# EAGLE schematic x-jalad rev2 (EAGLE 6.4)
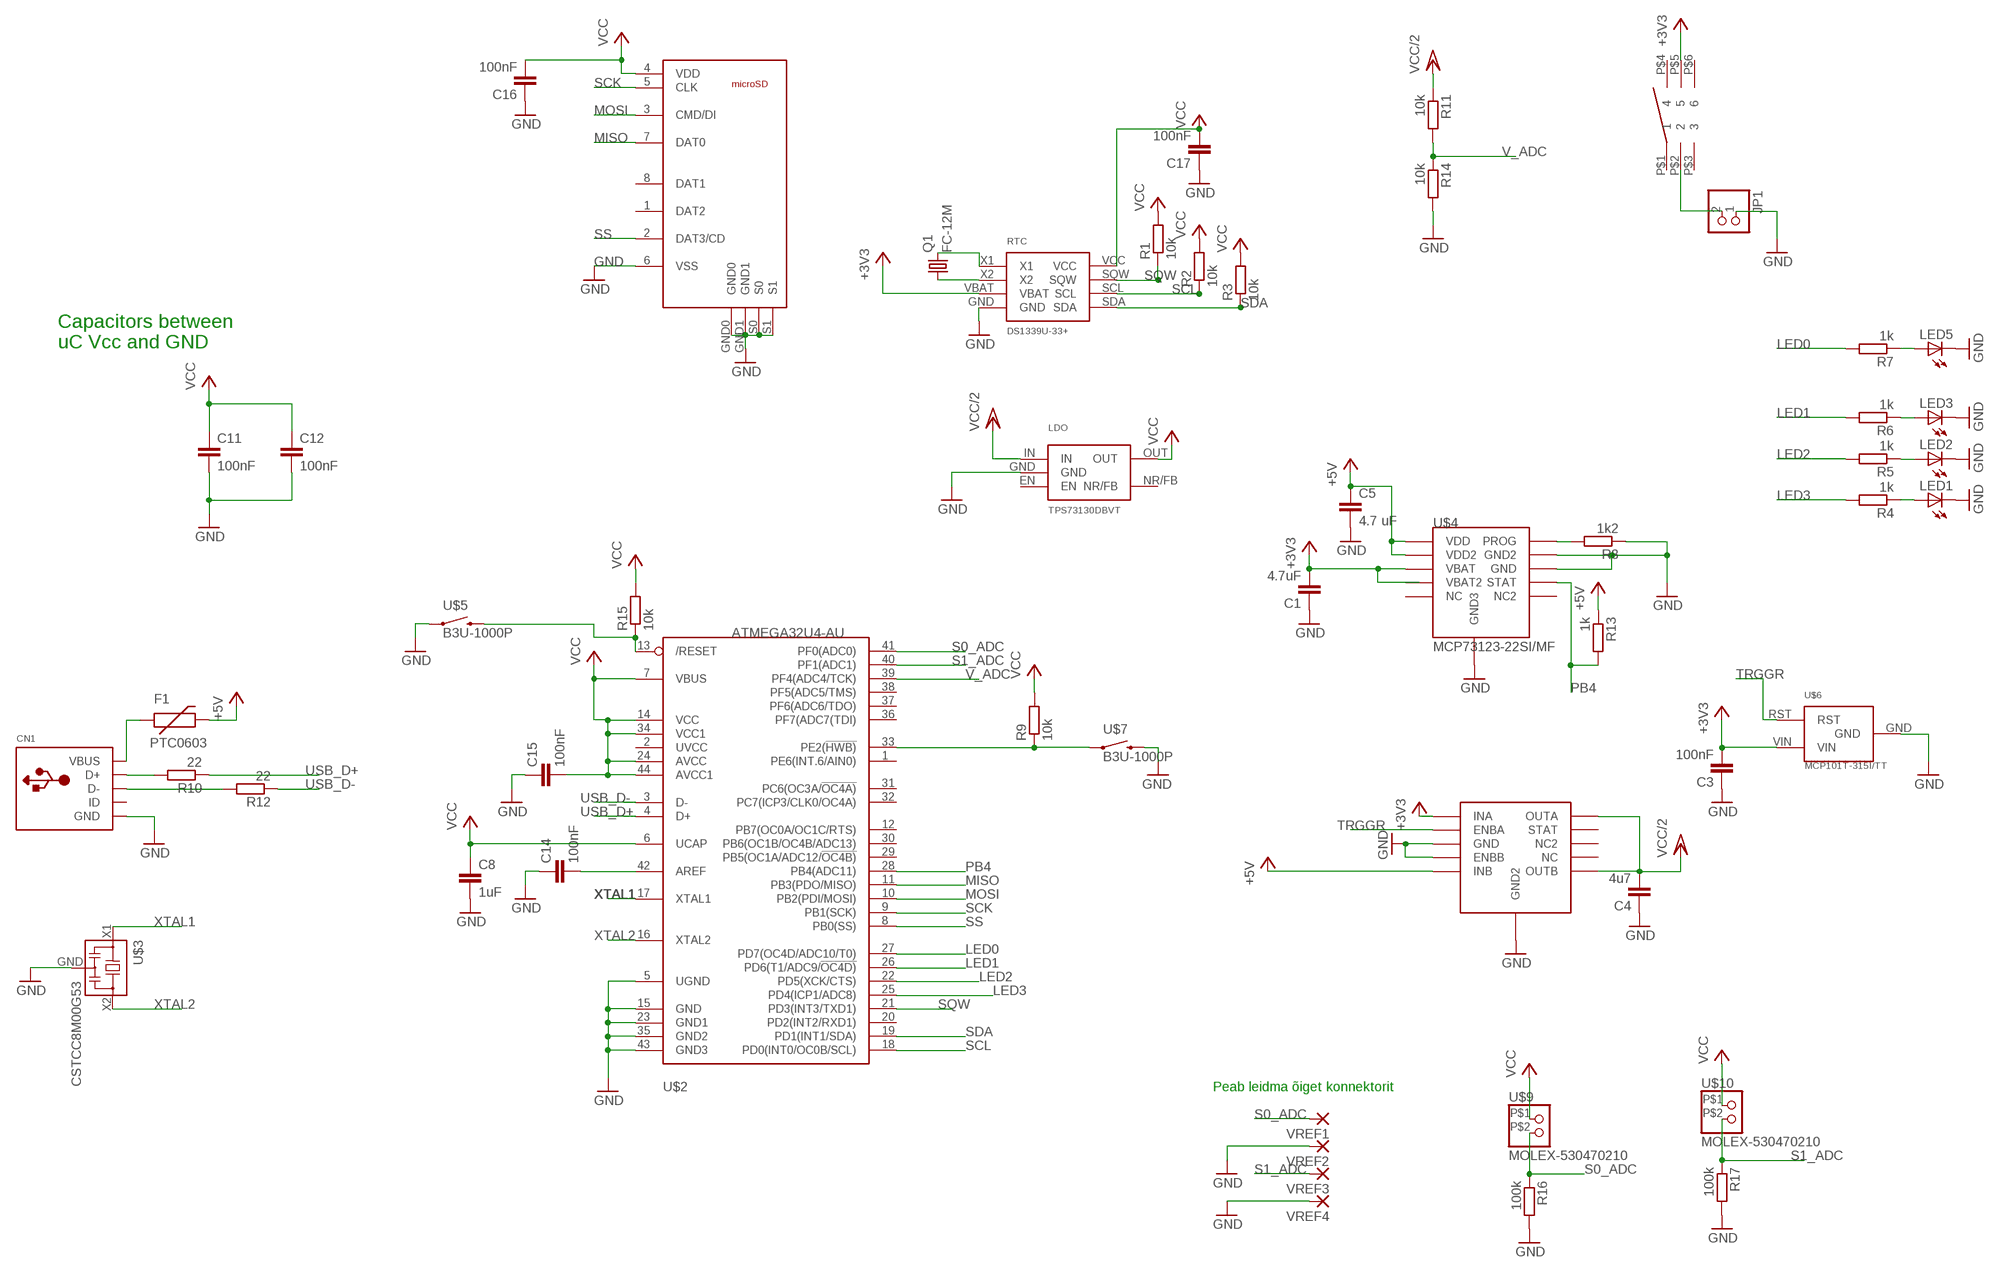
[diagram p0: schematic, sheet 1]

## Parts
2CH_IDEAL_DIODES  LTC4413EDD-1  [DFN10]
C1  4.7uF  CC0402  [C0402]
C3  100nF  CC0402  [C0402]
C4  4u7  CC0402  [C0402]
C5  4.7 uF  C-EUC0603  [C0603]
C8  1uF  CC0402  [C0402]
C11  100nF  CC0402  [C0402]
C12  100nF  CC0402  [C0402]
C14  100nF  CC0402  [C0402]
C15  100nF  CC0402  [C0402]
C16  100nF  CC0402  [C0402]
C17  100nF  CC0402  [C0402]
CN1  USBMINIB  [USB-MINIB]
F1  PTC0603  [0603]
JP1  PINHD-1X2/90  [1X02/90]
LDO  TPS73130DBVT  [SOT23-5]
LED1  LEDLD260  [LD260]
LED2  LEDLD260  [LD260]
LED3  LEDLD260  [LD260]
LED5  LEDLD260  [LD260]
Q1  FC-12M  [FC-12M]
R1  10k  RR0402  [R0402]
R2  10k  RR0402  [R0402]
R3  10k  RR0402  [R0402]
R4  1k  RR0402  [R0402]
R5  1k  RR0402  [R0402]
R6  1k  RR0402  [R0402]
R7  1k  RR0402  [R0402]
R8  1k2  RR0402  [R0402]
R9  10k  RR0402  [R0402]
R10  22  RR0402  [R0402]
R11  10k  RR0402  [R0402]
R12  22  RR0402  [R0402]
R13  1k  RR0402  [R0402]
R14  10k  RR0402  [R0402]
R15  10k  RR0402  [R0402]
R16  100k  RR0402  [R0402]
R17  100k  RR0402  [R0402]
RTC  DS1339U-33+  [MSOP8]
U$1  MICROSD_HRS  [MICROSD_HRS]
U$2  ATMEGA32U4-AU  [TQFP44]
U$3  CSTCC8M00G53  [SMDRESONATOR]
U$4  MCP73123-22SI/MF  [DFN10]
U$5  B3U-1000P  [SMD_BUTTON]
U$6  MCP101T-315I/TT  [SOT23-3]
U$7  B3U-1000P  [SMD_BUTTON]
U$8  SPPH410100  [SMD_LATCHING_BUTTON]
U$9  MOLEX-530470210  [SMD_PINHEADER]
U$10  MOLEX-530470210  [SMD_PINHEADER]
VREF1  3,17/1,3  [3,17/1,3]
VREF2  3,17/1,3  [3,17/1,3]
VREF3  3,17/1,3  [3,17/1,3]
VREF4  3,17/1,3  [3,17/1,3]

## Nets
+3V3: 2CH_IDEAL_DIODES.INA C1.2 C3.2 RTC.VBAT U$4.VBAT U$6.VIN U$8.P$5
+5V: 2CH_IDEAL_DIODES.INB C5.1 F1.2 R13.1 U$4.VDD U$4.VDD2
GND: 2CH_IDEAL_DIODES.ENBB 2CH_IDEAL_DIODES.GND 2CH_IDEAL_DIODES.GND2 C1.1 C3.1 C4.1 C5.2 C8.2 C11.2 C12.2 C14.1 C15.1 C16.1 C17.1 CN1.GND JP1.1 LDO.GND LED1.K(C) LED2.K(C) LED3.K(C) LED5.K(C) R8.1 R14.2 R16.2 R17.2 RTC.GND U$1.6(VSS) U$1.GND0 U$1.GND1 U$1.S0 U$1.S1 U$2.5(UGND) U$2.15(GND) U$2.23(GND1) U$2.35(GND2) U$2.43(GND3) U$3.GND U$4.GND U$4.GND2 U$4.GND3 U$5.P$1 U$6.GND U$7.P$2 VREF2.1(P) VREF4.1(P)
LED0: R7.2 U$2.27(PD7(OC4D/ADC10/T0))
LED1: R6.2 U$2.26(PD6(T1/ADC9/!OC4D))
LED2: R5.2 U$2.22(PD5(XCK/CTS))
LED3: R4.2 U$2.25(PD4(ICP1/ADC8))
MISO: U$1.7(DAT0) U$2.11(PB3(PDO/MISO))
MOSI: U$1.3(CMD/DI) U$2.10(PB2(PDI/MOSI))
N$1: LED5.A R7.1
N$2: JP1.2 U$8.P$2
N$3: LED1.A R4.1
N$4: R8.2 U$4.PROG
N$5: LED2.A R5.1
N$6: LED3.A R6.1
N$16: Q1.1 RTC.X2
N$17: CN1.VBUS F1.1
N$18: CN1.D+ R10.2
N$19: CN1.D- R12.2
N$20: Q1.2 RTC.X1
N$21: C14.2 U$2.42(AREF)
NRST: R15.1 U$2.13(/RESET) U$5.P$2
NRST1: R9.1 U$2.33(PE2(!HWB)) U$7.P$1
PB4: R13.2 U$2.28(PB4(ADC11)) U$4.STAT
S0_ADC: R16.1 U$2.41(PF0(ADC0)) U$9.P$2 VREF1.1(P)
S1_ADC: R17.1 U$2.40(PF1(ADC1)) U$10.P$2 VREF3.1(P)
SCK: U$1.5(CLK) U$2.9(PB1(SCK))
SCL: R2.1 RTC.SCL U$2.18(PD0(INT0/OC0B/SCL))
SDA: R3.1 RTC.SDA U$2.19(PD1(INT1/SDA))
SQW: R1.1 RTC.SQW U$2.21(PD3(INT3/TXD1))
SS: U$1.2(DAT3/CD) U$2.8(PB0(SS))
TRGGR: 2CH_IDEAL_DIODES.ENBA U$6.RST
USB_D+: R10.1 U$2.4(D+)
USB_D-: R12.1 U$2.3(D-)
V_ADC: R11.2 R14.1 U$2.39(PF4(ADC4/TCK))
VCC: C8.1 C11.1 C12.1 C15.2 C16.2 C17.2 LDO.OUT R1.2 R2.2 R3.2 R9.2 R15.2 RTC.VCC U$1.4(VDD) U$2.6(UCAP) U$2.7(VBUS) U$2.14(VCC) U$2.24(AVCC) U$2.34(VCC1) U$2.44(AVCC1) U$9.P$1 U$10.P$1
VCC/2: 2CH_IDEAL_DIODES.OUTA 2CH_IDEAL_DIODES.OUTB C4.2 LDO.IN R11.1
XTAL1: U$2.17(XTAL1) U$3.X1
XTAL2: U$2.16(XTAL2) U$3.X2
Unconnected: 2CH_IDEAL_DIODES.NC 2CH_IDEAL_DIODES.NC2 2CH_IDEAL_DIODES.STAT CN1.ID LDO.EN LDO.NR/FB U$1.1(DAT2) U$1.8(DAT1) U$2.1(PE6(INT.6/AIN0)) U$2.2(UVCC) U$2.12(PB7(OC0A/OC1C/RTS)) U$2.20(PD2(INT2/RXD1)) U$2.29(PB5(OC1A/ADC12/!OC4B)) U$2.30(PB6(OC1B/OC4B/ADC13)) U$2.31(PC6(OC3A/!OC4A)) U$2.32(PC7(ICP3/CLK0/OC4A)) U$2.36(PF7(ADC7(TDI)) U$2.37(PF6(ADC6/TDO)) U$2.38(PF5(ADC5/TMS)) U$4.NC U$4.NC2 U$4.VBAT2 U$8.P$1 U$8.P$3 U$8.P$4 U$8.P$6

## Notes on the sheet
- Capacitors between
  uC Vcc and GND
- Peab leidma õiget konnektorit

## Library data of the parts
2CH_IDEAL_DIODES = 2_ch_ideal_diode:LTC4413EDD-1
C1 C3 C4 C8 C11 C12 C14-C17 = eagle-ltspice:C: CAPACITOR, European symbol; SPICEMODEL: NONE; SPICEPREFIX: C
C5 = rcl:C-EU: CAPACITOR, European symbol
CN1 = adafruit:USB: USB Connectors USBMINIB - Surface Mount Female Mini-B USB Connector 4UConnector: 06564 By microbuilder.eu Thru-hole RA Female Mini-B USB Connector 4UConnector: 18732 By ladyada.net
F1 = SparkFun:PTC: Resettable Fuse PTC Resettable Fuse. Spark Fun Electronics SKU : COM-08357
JP1 = pinhead:PINHD-1X2: PIN HEADER
LDO = TPS73130DBVT:TPS73130DBVT
LED1-LED3 LED5 = led:LED: LED OSRAM: - CHIPLED LG R971, LG N971, LY N971, LG Q971, LY Q971, LO R971, LY R971 LH N974, LH R974 LS Q976, LO Q976, LY Q976 LO Q996 - Hyper CHIPLED LW Q18S LB Q993, LB Q99A, LB R99A - SideLED LS A670, LO A670, LY A670, LG A670, LP A670 LB A673, LV A673, LT A673, LW A673 LH A674 LY A675 LS A676, LA A676, LO A676, LY A676, LW A676 LS A679, LY A679, LG A679 - Hyper Micro SIDELED® LS Y876, LA Y876, LO Y876, LY Y876 LT Y87S - SmartLED LW L88C, LW L88S LB L89C, LB L89S, LG L890 LS L89K, LO L89K, LY L89K LS L896, LA L896, LO L896, LY L896 - TOPLED LS T670, LO T670, LY T670, LG T670, LP T670 LSG T670, LSP T670, LSY T670, LOP T670, LYG T670 LG T671, LOG T671, LSG T671 LB T673, LV T673, LT T673, LW T673 LH T674 LS T676, LA T676, LO T676, LY T676, LB T676, LH T676, LSB T676, LW T676 LB T67C, LV T67C, LT T67C, LS T67K, LO T67K, LY T67K, LW E67C LS E67B, LA E67B, LO E67B, LY E67B, LB E67C, LV E67C, LT E67C LW T67C LS T679, LY T679, LG T679 LS T770, LO T770, LY T770, LG T770, LP T770 LB T773, LV T773, LT T773, LW T773 LH T774 LS E675, LA E675, LY E675, LS T675 LS T776, LA T776, LO T776, LY T776, LB T776 LHGB T686 LT T68C, LB T68C - Hyper Mini TOPLED® LB M676 - Mini TOPLED Santana® LG M470 LS M47K, LO M47K, LY M47K Source: http://www.osram.convergy.de LUXEON: - LUMILED® LXK2-PW12-R00, LXK2-PW12-S00, LXK2-PW14-U00, LXK2-PW14-V00 LXK2-PM12-R00, LXK2-PM12-S00, LXK2-PM14-U00 LXK2-PE12-Q00, LXK2-PE12-R00, LXK2-PE12-S00, LXK2-PE14-T00, LXK2-PE14-U00 LXK2-PB12-K00, LXK2-PB12-L00, LXK2-PB12-M00, LXK2-PB14-N00, LXK2-PB14-P00, LXK2-PB14-Q00 LXK2-PR12-L00, LXK2-PR12-M00, LXK2-PR14-Q00, LXK2-PR14-R00 LXK2-PD12-Q00, LXK2-PD12-R00, LXK2-PD12-S00 LXK2-PH12-R00, LXK2-PH12-S00 LXK2-PL12-P00, LXK2-PL12-Q00, LXK2-PL12-R00 Source: www.luxeon.com KINGBRIGHT: KA-3528ASYC Source: www.kingbright.com
Q1 = crystal:FC-12M: kHz RANGE CRYSTAL UNIT LOW PROFILE SMD Source: Epson Toyocom FC-12M.pdf
R1-R17 = eagle-ltspice:R: RESISTOR, European symbol; SPICEMODEL: NONE; SPICEPREFIX: R
RTC = DS1339U-33+:DS1339U-33+
U$1 = custom:MICROSD_HRS
U$2 = adafruit:ATMEGA32U4: http://www.ladyada.net/library/eagle
U$3 = smd_resonator:CSTCC8M00G53
U$4 = mcp73123-22si:MCP73123-22SI/MF
U$5 U$7 = smd_button:B3U-1000P
U$6 = MCP101T-315I:MCP101T-315I/TT
U$8 = start_button:SPPH410100
U$9 U$10 = pwr_connector:MOLEX-530470210
VREF1-VREF4 = wirepad:3,17/1,3: THROUGH-HOLE PAD